# Altium schematic sheet Project_Information.SchDoc: =project_title
size Tabloid; CompanyName: Luxonis Holding; Organization: Luxonis Holding; Address1: 1925 Harmony Park Drive; Address2: Westminster, CO; Address3: 80234; Address4: United States; SheetNumber: 2; SheetTotal: 8
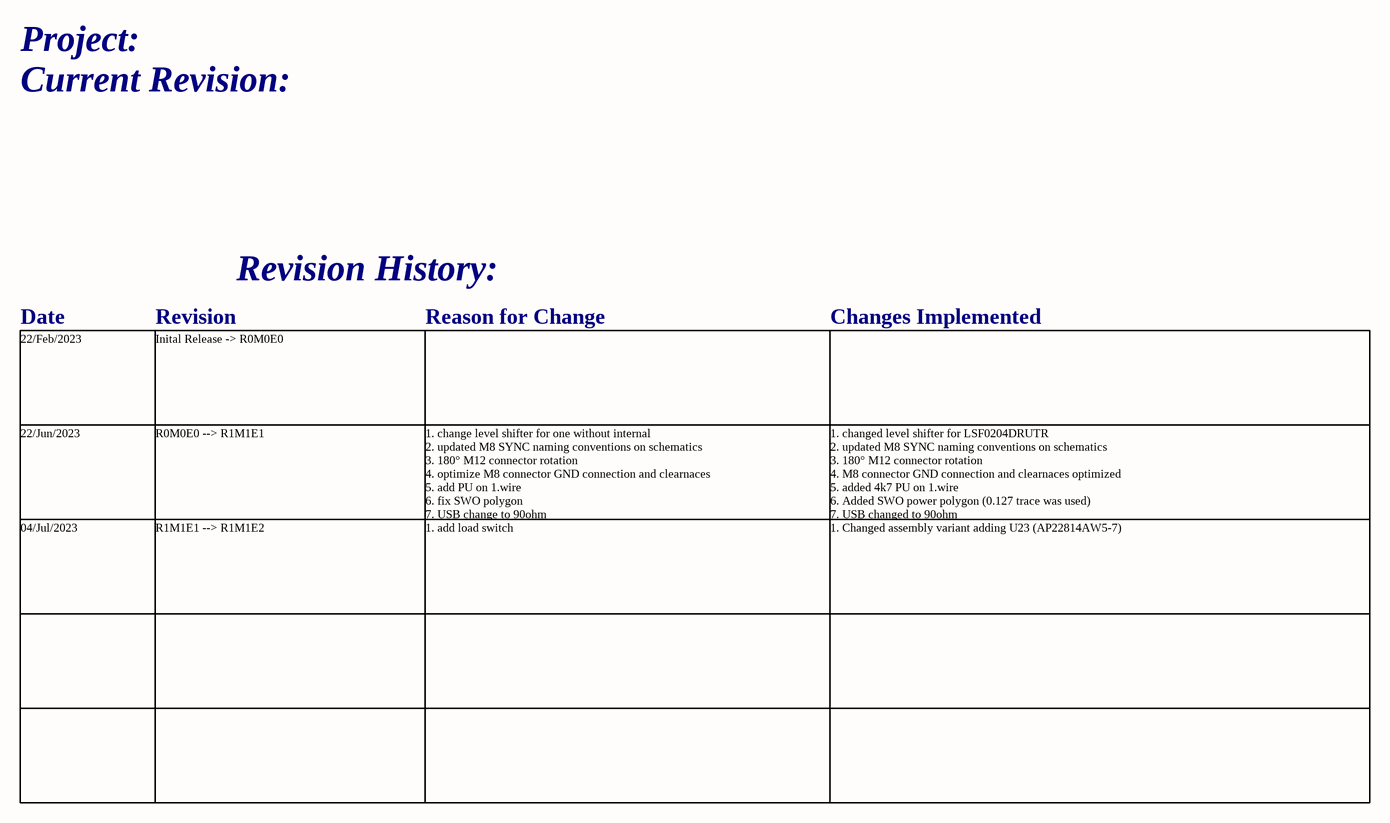
[diagram p0: Project_Information.SchDoc]

## Notes on the sheet
- Project:
- Current Revision:
- Revision History:
- Date
- Revision
- Reason for Change
- Changes Implemented
- 22/Feb/2023
- Inital Release -> R0M0E0
- 22/Jun/2023
- R0M0E0 --> R1M1E1
- 1. change level shifter for one without internal
  2. updated M8 SYNC naming conventions on schematics
  3. 180° M12 connector rotation
  4. optimize M8 connector GND connection and clearnaces
  5. add PU on 1.wire
  6. fix SWO polygon
  7. USB change to 90ohm
- 1. changed level shifter for LSF0204DRUTR
  2. updated M8 SYNC naming conventions on schematics
  3. 180° M12 connector rotation
  4. M8 connector GND connection and clearnaces optimized
  5. added 4k7 PU on 1.wire
  6. Added SWO power polygon (0.127 trace was used)
  7. USB changed to 90ohm
- 04/Jul/2023
- R1M1E1 --> R1M1E2
- 1. add load switch
- 1. Changed assembly variant adding U23 (AP22814AW5-7)
- Title
- Size:
- Date:
- Tabloid
- Number:
- Time:
- Revision:
- Sheet
- of
- Drawn by: